# Altium schematic sheet HighVoltageSensor.SchDoc
size A
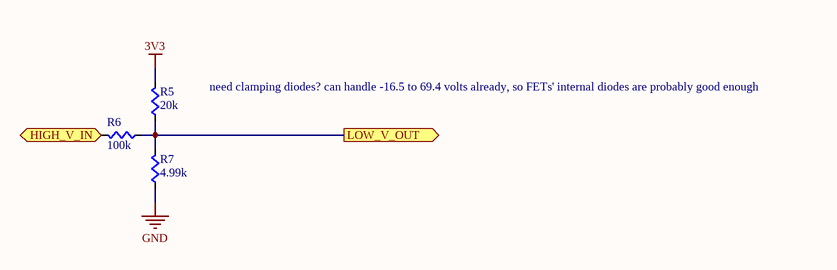
[diagram p0: HighVoltageSensor.SchDoc]

## Parts
R5  value 20k  [RES0603]  (hidden comment: Res)
R6  value 100k  [RES0603]  (hidden comment: Res)
R7  value 4.99k  [RES0603]  (hidden comment: Res)

## Ports
HIGH_V_IN (in), LOW_V_OUT (out)

## Nets
3V3: R5.1(A)
GND: R7.2(B)
HIGH_V_IN: R6.1(A) ; port HIGH_V_IN
LOW_V_OUT: R5.2(B) R6.2(B) R7.1(A) ; port LOW_V_OUT

## Notes on the sheet
- need clamping diodes? can handle -16.5 to 69.4 volts already, so FETs' internal diodes are probably good enough

## Library data of the parts
R5-R7 = Res: Supplier 1: Digi-Key
  R5: Supplier Part Number 1: RG16P20.0KBCT-ND
  R6: Supplier Part Number 1: RG16P100KBCT-ND
  R7: Supplier Part Number 1: RG16P4.99KBCT-ND